# Altium schematic sheet MCU.SchDoc
size A; Address1: Nhatkhongbuon; Address2: Nhatkhongbuon; Address3: Nhatkhongbuon; Address4: Nhatkhongbuon; SheetNumber: 3; SheetTotal: 5
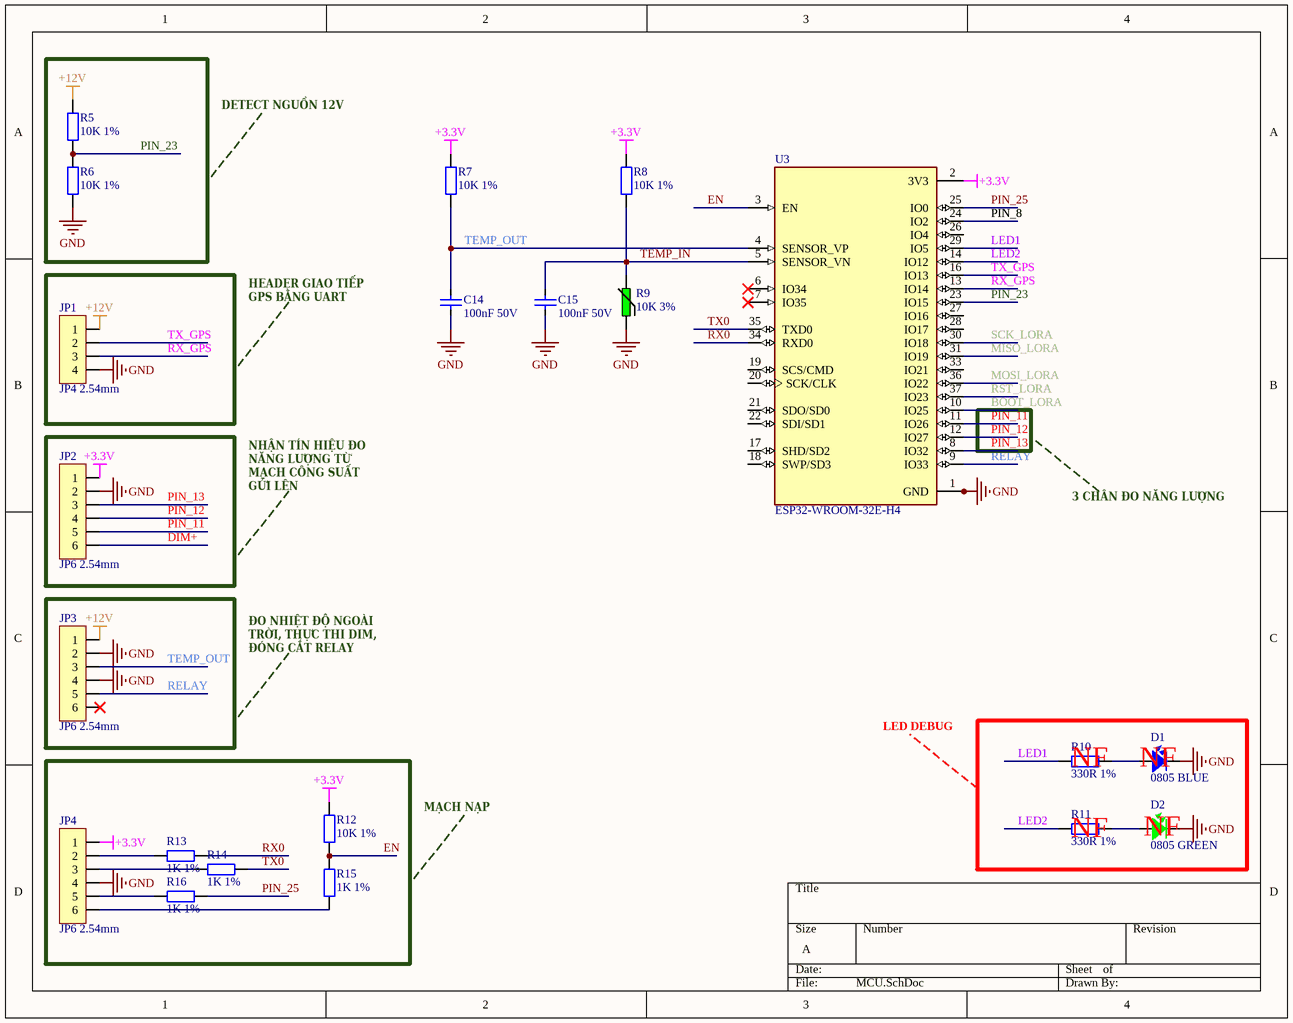
[diagram p0: MCU.SchDoc]

## Parts
C14  100nF 50V  [CAP_SMD_0805]
C15  100nF 50V  [CAP_SMD_0805]
D1  0805 BLUE  [LED-0805-Blue]
D2  0805 GREEN  [LED-0805-Green]
JP1  JP4 2.54mm  [JP4_M]
JP2  JP6 2.54mm  [JP6_M]
JP3  JP6 2.54mm  [JP6_M]
JP4  JP6 2.54mm  [JP6_M]
R5  10K 1%  [RES_SMD_0805]
R6  10K 1%  [RES_SMD_0805]
R7  10K 1%  [RES_SMD_0805]
R8  10K 1%  [RES_SMD_0805]
R9  10K 3%  [NTC_2.54.]
R10  330R 1%  [RES_SMD_0805]
R11  330R 1%  [RES_SMD_0805]
R12  10K 1%  [RES_SMD_0805]
R13  1K 1%  [RES_SMD_0805]
R14  1K 1%  [RES_SMD_0805]
R15  1K 1%  [RES_SMD_0805]
R16  1K 1%  [RES_SMD_0805]
U3  ESP32-WROOM-32E-H4  [ESP32-WROOM-32]

## Nets
+3.3V: JP2.1 JP4.1 R7.2 R8.2 R12.2 U3.2(3V3)
+12V: JP1.1 JP3.1 R5.2
GND: C14.1 C15.1 D1.2 D2.2 JP1.4 JP2.2 JP3.2 JP3.4 JP4.4 R6.1 R9.1 U3.1(GND) U3.15(GND) U3.38(GND) U3.39_1(GND) U3.39_2(GND) U3.39_3(GND) U3.39_4(GND) U3.39_5(GND) U3.39_6(GND) U3.39_7(GND) U3.39_8(GND) U3.39_9(GND) U3.39_10(GND) U3.39_11(GND) U3.39_12(GND) U3.39_13(GND) U3.39_14(GND) U3.39_15(GND) U3.39_16(GND) U3.39_17(GND) U3.39_18(GND) U3.39_19(GND) U3.39_20(GND) U3.39_21(GND)
BOOT_LORA: U3.10(IO25)
DIM+: JP2.6
EN: R12.1 R15.2 U3.3(EN)
LED1: R10.1 U3.29(IO5)
LED2: R11.1 U3.14(IO12)
MISO_LORA: U3.31(IO19)
MOSI_LORA: U3.36(IO22)
PIN_8: U3.24(IO2)
PIN_11: JP2.5 U3.11(IO26)
PIN_12: JP2.4 U3.12(IO27)
PIN_13: JP2.3 U3.8(IO32)
PIN_23: R5.1 R6.2 U3.23(IO15)
PIN_25: R16.2 U3.25(IO0)
RELAY: JP3.5 U3.9(IO33)
RST_LORA: U3.37(IO23)
RX0: R13.2 U3.34(RXD0)
RX_GPS: JP1.3 U3.13(IO14)
SCK_LORA: U3.30(IO18)
TEMP_IN: C15.2 R8.1 R9.2 U3.5(SENSOR_VN)
TEMP_OUT: C14.2 JP3.3 R7.1 U3.4(SENSOR_VP)
TX0: R14.2 U3.35(TXD0)
TX_GPS: JP1.2 U3.16(IO13)
NetD1_1: D1.1 R10.2
NetD2_1: D2.1 R11.2
NetJP4_2: JP4.2 R13.1
NetJP4_3: JP4.3 R14.1
NetJP4_5: JP4.5 R16.1
NetJP4_6: JP4.6 R15.1

Not connected (* = marked no-connect by the designer): JP3 6*; U3 6(IO34)* 7(IO35)* 17(SHD/SD2) 18(SWP/SD3) 19(SCS/CMD) 20(SCK/CLK) 21(SDO/SD0) 22(SDI/SD1) 26(IO4) 27(IO16) 28(IO17) 33(IO21)

## Notes on the sheet
- DETECT NGUỒN 12V
- HEADER GIAO TIẾP GPS BẰNG UART
- NHẬN TÍN HIỆU ĐO NĂNG LƯỢNG TỪ MẠCH CÔNG SUẤT GỬI LÊN
- 3 CHÂN ĐO NĂNG LƯỢNG
- ĐO NHIỆT ĐỘ NGOÀI TRỜI, THỰC THI DIM, ĐÓNG CẮT RELAY
- LED DEBUG
- (near R10) NF
- (near D1) NF
- MẠCH NẠP
- (near R11) NF
- (near D2) NF

## Library data of the parts
C14 C15 = C0805_MLCC_100nF_50V: 0.1 µF ±10% 50V Ceramic Capacitor X7R 0805 (2012 Metric); Manufacturer: YAGEO; Manufacture Part Number: CC0805KRX7R9BB104; Packaging: Cut Tape (CT); Link: https://www.digikey.cn/en/products/detail/yageo/CC0805KRX7R9BB104/302874; Price: $0.10
D1 = LED_0805_BLUE: Blue 470nm LED Indication - Discrete 3.2V 0805 (2012 Metric); Manufacturer: Würth Elektronik; Manufacture Part Number: 150080BS75000; Packaging: Cut Tape (CT); Link: https://www.digikey.cn/en/products/detail/w%C3%BCrth-elektronik/150080BS75000/4489912; Price: $0.19
D2 = LED_0805_GREEN: Green 520nm LED Indication - Discrete 3.2V 0805 (2012 Metric); Manufacturer: Würth Elektronik; Manufacture Part Number: 150080GS75000; Packaging: Cut Tape (CT); Link: https://www.digikey.cn/en/products/detail/w%C3%BCrth-elektronik/150080GS75000/4489915; Price: $0.19
JP1 = JP4M: Connector Header Through Hole 4 position 0.100" (2.54mm); Manufacturer: Würth Elektronik; Manufacture Part Number: 61300411121; Packaging: Bulk; Link: https://www.digikey.cn/en/products/detail/w%C3%BCrth-elektronik/61300411121/4846827?s=N4IgTCBcDaIGwEYDMAGFAWBWwJAXQF8g; Price: $0.19
JP2-JP4 = JP6M: Connector Header Through Hole 6 position 0.100" (2.54mm); Manufacturer: Würth Elektronik; Manufacture Part Number: 61300611121; Packaging: Bulk; Link: https://www.digikey.cn/en/products/detail/w%C3%BCrth-elektronik/61300611121/4846833; Price: $0.35
R5-R8 R12 = R0805_10K: 10 kOhms ±1% 0.125W, 1/8W Chip Resistor 0805 (2012 Metric) Moisture Resistant Thick Film; Manufacturer: YAGEO; Manufacture Part Number: RC0805FR-0710KL; Packaging: Cut Tape (CT); Price: $0.10; Link: https://www.digikey.cn/en/products/detail/yageo/RC0805FR-0710KL/727535
R9 = NTC_10K_: NTC Thermistor 10k Bead; Manufacturer: Vishay Beyschlag/Draloric/BC Components; Manufacture Part Number: NTCLE203E3103HB0; Packaging: Bulk; Link: https://www.digikey.com/en/products/detail/vishay-beyschlag-draloric-bc-components/NTCLE203E3103HB0/2230772; Price: $0.13
R10 R11 = R0805_330R: 330 Ohms ±1% 0.125W, 1/8W Chip Resistor 0805 (2012 Metric) Automotive AEC-Q200 Thick Film; Manufacturer: Stackpole Electronics Inc; Manufacture Part Number: RMCF0805FT330R; Packaging: Cut Tape (CT); Link: https://www.digikey.cn/en/products/detail/stackpole-electronics-inc/RMCF0805FT330R/1760484; Price: $0.10
R13-R16 = R0805_1K: 1 kOhms ±1% 0.125W, 1/8W Chip Resistor 0805 (2012 Metric) Moisture Resistant Thick Film; Manufacturer: YAGEO; Manufacture Part Number: 311-1.00KCRCT-ND; Packaging: Cut Tape (CT); Link: https://www.digikey.com/en/products/detail/yageo/RC0805FR-071KL/727444; Price: $0.10
U3 = ESP32-WROOM-32E-H4: Bluetooth, WiFi 802.11b/g/n, Bluetooth v4.2 +EDR, Class 1, 2 and 3 Transceiver Module 2.4GHz ~ 2.5GHz Integrated, Trace Surface Mount; Manufacturer: Espressif Systems; Manufacture Part Number: ESP32-WROOM-32E-H4; Packaging: Cut Tape (CT); Link: https://www.digikey.cn/en/products/detail/espressif-systems/ESP32-WROOM-32E-H4/12696413; Price: $2.68